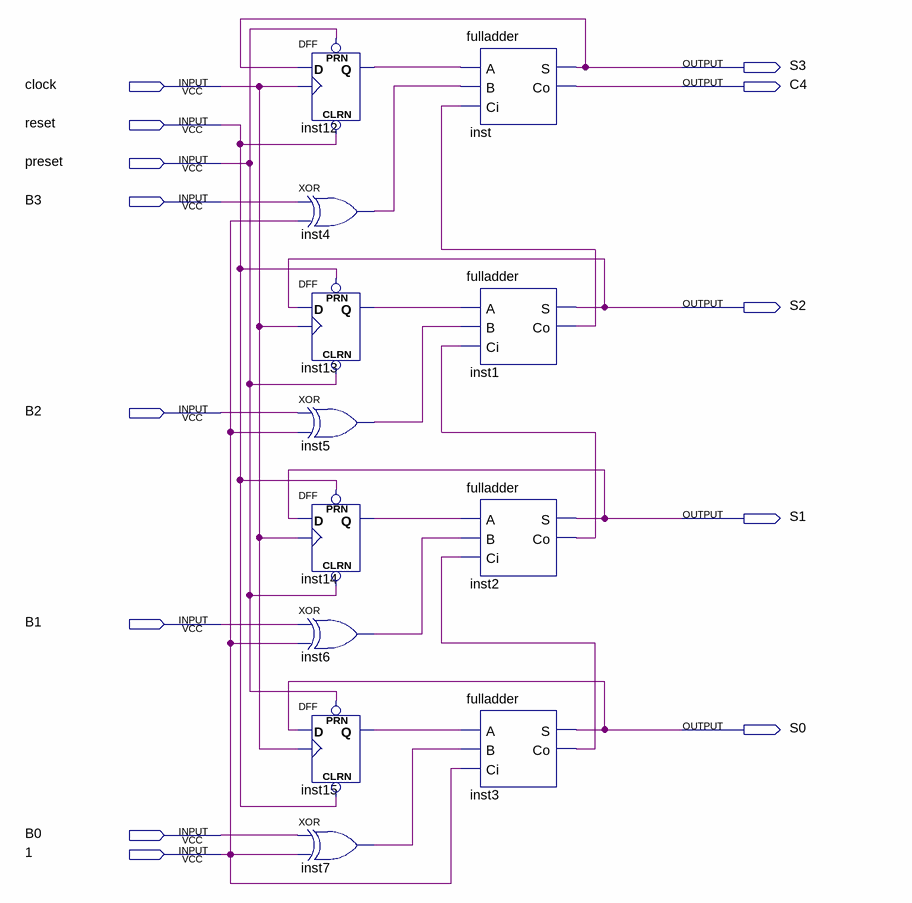
[diagram p0: schematic sheet]
// Quartus schematic ouyou.bdf as structural Verilog: 12 symbols, 13 pins
module ouyou (
  input  clock,
  input  reset,
  input  preset,
  input  B3,
  input  B2,
  input  B1,
  input  B0,
  input  \1 ,
  output S3,
  output C4,
  output S2,
  output S1,
  output S0
);

  wire inst1_co, inst2_co, inst3_co, inst4_out, inst5_out, inst6_out, inst7_out, inst12_q, inst13_q,
       inst14_q, inst15_q;

  DFF inst12 (.CLRN(reset), .CLK(clock), .D(S3), .PRN(preset), .Q(inst12_q));
  xor inst4 (inst4_out, B3, \1 );
  DFF inst13 (.CLRN(preset), .CLK(clock), .D(S2), .PRN(reset), .Q(inst13_q));
  xor inst5 (inst5_out, B2, \1 );
  DFF inst14 (.CLRN(preset), .CLK(clock), .D(S1), .PRN(reset), .Q(inst14_q));
  xor inst6 (inst6_out, B1, \1 );
  DFF inst15 (.CLRN(reset), .CLK(clock), .D(S0), .PRN(preset), .Q(inst15_q));
  xor inst7 (inst7_out, B0, \1 );
  fulladder inst (.A(inst12_q), .B(inst4_out), .Ci(inst1_co), .S(S3), .Co(C4));
  fulladder inst1 (.A(inst13_q), .B(inst5_out), .Ci(inst2_co), .S(S2), .Co(inst1_co));
  fulladder inst2 (.A(inst14_q), .B(inst6_out), .Ci(inst3_co), .S(S1), .Co(inst2_co));
  fulladder inst3 (.A(inst15_q), .B(inst7_out), .Ci(\1 ), .S(S0), .Co(inst3_co));
endmodule
